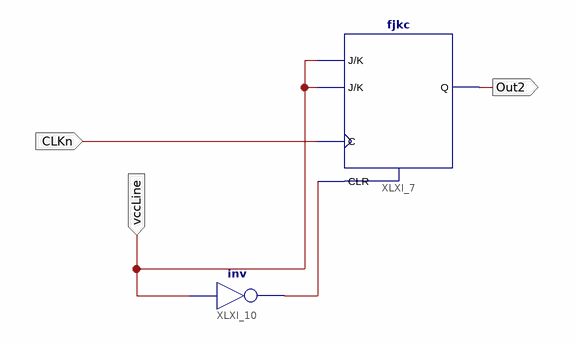
[diagram p0: schematic sheet 1]
// Xilinx ISE schematic Mod2.sch (spartan6) as structural Verilog: 2 symbols, 3 ports
module Mod2 (
  input  vccLine,
  input  CLKn,
  output Out2
);

  wire dontCLR;

  fjkc XLXI_7 (.C(CLKn), .CLR(dontCLR), .J(vccLine), .K(vccLine), .Q(Out2));
  not XLXI_10 (dontCLR, vccLine);
endmodule
